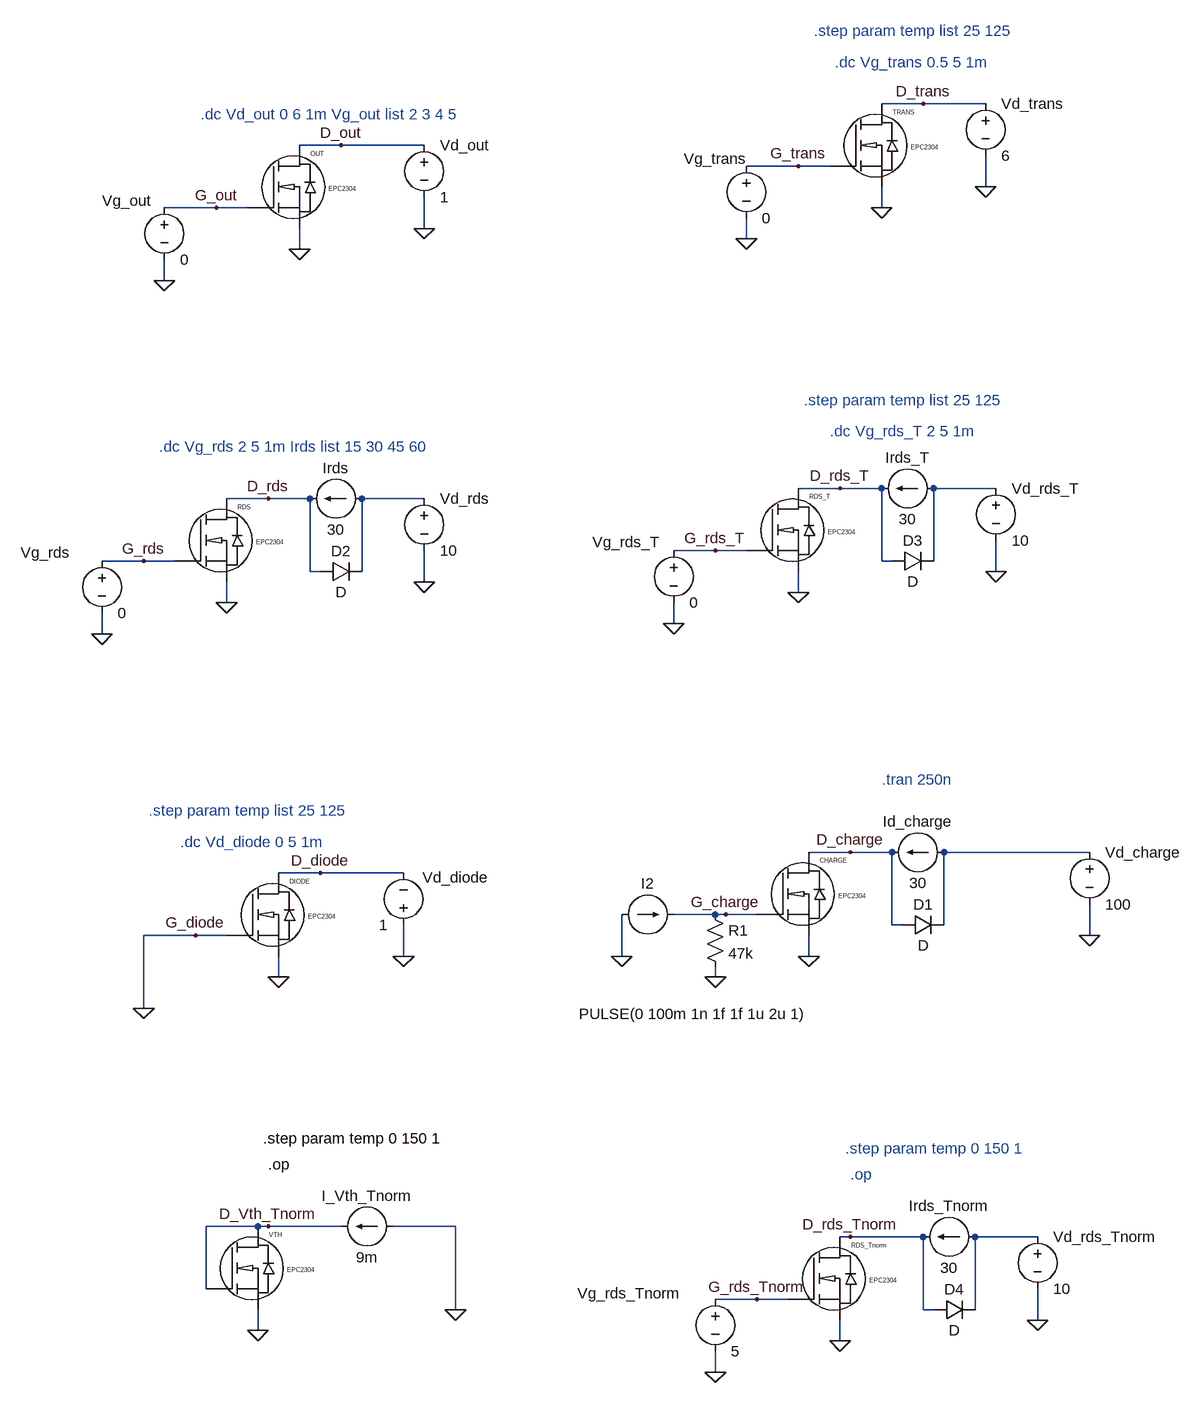
[diagram p0: schematic EPC2304_FET_Model_derivation.asc]
EPC2304_FET_Model_derivation.asc, the LTspice schematic file:
Version 4.1
SHEET 1 2668 1988
WIRE 2176 16 2112 16
WIRE 2272 16 2176 16
WIRE 1280 80 1216 80
WIRE 1408 80 1280 80
WIRE 1984 112 1904 112
WIRE 2032 112 1984 112
WIRE 2272 144 2272 96
WIRE 1088 176 1008 176
WIRE 1136 176 1088 176
WIRE 2112 176 2112 144
WIRE 1408 208 1408 160
WIRE 1904 224 1904 192
WIRE 1216 240 1216 208
WIRE 1008 288 1008 256
WIRE 2048 608 1984 608
WIRE 2112 608 2048 608
WIRE 2288 608 2192 608
WIRE 1168 624 1104 624
WIRE 1232 624 1168 624
WIRE 1408 624 1312 624
WIRE 1856 704 1792 704
WIRE 1904 704 1856 704
WIRE 976 720 912 720
WIRE 1024 720 976 720
WIRE 2112 720 2112 608
WIRE 2128 720 2112 720
WIRE 2192 720 2192 608
WIRE 1232 736 1232 624
WIRE 1248 736 1232 736
WIRE 1312 736 1312 624
WIRE 2288 736 2288 688
WIRE 1408 752 1408 704
WIRE 1984 768 1984 736
WIRE 1104 784 1104 752
WIRE 1792 816 1792 784
WIRE 912 832 912 800
WIRE 2064 1168 2000 1168
WIRE 2128 1168 2064 1168
WIRE 2432 1168 2208 1168
WIRE 1248 1200 1184 1200
WIRE 1376 1200 1248 1200
WIRE 1856 1264 1792 1264
WIRE 1872 1264 1856 1264
WIRE 1920 1264 1872 1264
WIRE 2128 1280 2128 1168
WIRE 2144 1280 2128 1280
WIRE 2208 1280 2208 1168
WIRE 1056 1296 976 1296
WIRE 1104 1296 1056 1296
WIRE 2432 1296 2432 1248
WIRE 1376 1328 1376 1280
WIRE 1712 1328 1712 1264
WIRE 2000 1328 2000 1296
WIRE 1184 1360 1184 1328
WIRE 1856 1360 1856 1344
WIRE 976 1408 976 1296
WIRE 1152 1744 1072 1744
WIRE 1168 1744 1152 1744
WIRE 1280 1744 1168 1744
WIRE 1456 1744 1360 1744
WIRE 2064 1760 2048 1760
WIRE 2176 1760 2064 1760
WIRE 2352 1760 2256 1760
WIRE 1072 1840 1072 1744
WIRE 1920 1856 1856 1856
WIRE 1968 1856 1920 1856
WIRE 1456 1872 1456 1744
WIRE 2176 1872 2176 1760
WIRE 2192 1872 2176 1872
WIRE 2256 1872 2256 1760
WIRE 2352 1888 2352 1840
WIRE 1152 1904 1152 1872
WIRE 2048 1920 2048 1888
WIRE 1856 1968 1856 1936
FLAG 2000 1328 0
FLAG 2432 1296 0
FLAG 2064 1168 D_charge
FLAG 1872 1264 G_charge
FLAG 1856 1360 0
FLAG 1216 240 0
FLAG 1008 288 0
FLAG 1408 208 0
FLAG 1280 80 D_out
FLAG 1088 176 G_out
FLAG 2112 176 0
FLAG 1904 224 0
FLAG 2272 144 0
FLAG 2176 16 D_trans
FLAG 1984 112 G_trans
FLAG 1104 784 0
FLAG 1408 752 0
FLAG 1168 624 D_rds
FLAG 912 832 0
FLAG 976 720 G_rds
FLAG 1984 768 0
FLAG 2288 736 0
FLAG 2048 608 D_rds_T
FLAG 1792 816 0
FLAG 1856 704 G_rds_T
FLAG 1712 1328 0
FLAG 1184 1360 0
FLAG 976 1408 0
FLAG 1376 1328 0
FLAG 1248 1200 D_diode
FLAG 1056 1296 G_diode
FLAG 2048 1920 0
FLAG 2352 1888 0
FLAG 2064 1760 D_rds_Tnorm
FLAG 1856 1968 0
FLAG 1920 1856 G_rds_Tnorm
FLAG 1152 1904 0
FLAG 1456 1872 0
FLAG 1168 1744 D_Vth_Tnorm
SYMBOL voltage 2432 1152 R0
SYMATTR InstName Vd_charge
SYMATTR Value 100
SYMBOL current 2208 1168 R90
WINDOW 0 -32 40 VBottom 2
WINDOW 3 32 40 VTop 2
SYMATTR InstName Id_charge
SYMATTR Value 30
SYMBOL current 1712 1264 R270
WINDOW 0 32 40 VTop 2
WINDOW 3 -137 110 VBottom 2
WINDOW 123 0 0 Left 0
WINDOW 39 0 0 Left 0
SYMATTR InstName I2
SYMATTR Value PULSE(0 100m 1n 1f 1f 1u 2u 1)
SYMBOL res 1840 1248 R0
SYMATTR InstName R1
SYMATTR Value 47k
SYMBOL diode 2144 1296 R270
WINDOW 0 32 32 VTop 2
WINDOW 3 0 32 VBottom 2
SYMATTR InstName D1
SYMBOL voltage 1008 160 R0
WINDOW 0 -96 5 Left 2
SYMATTR InstName Vg_out
SYMATTR Value 0
SYMBOL voltage 1408 64 R0
SYMATTR InstName Vd_out
SYMATTR Value 1
SYMBOL voltage 1904 96 R0
WINDOW 0 -96 5 Left 2
SYMATTR InstName Vg_trans
SYMATTR Value 0
SYMBOL voltage 2272 0 R0
SYMATTR InstName Vd_trans
SYMATTR Value 6
SYMBOL voltage 912 704 R0
WINDOW 0 -125 3 Left 2
SYMATTR InstName Vg_rds
SYMATTR Value 0
SYMBOL voltage 1408 608 R0
SYMATTR InstName Vd_rds
SYMATTR Value 10
SYMBOL current 1312 624 R90
WINDOW 0 -32 40 VBottom 2
WINDOW 3 32 40 VTop 2
SYMATTR InstName Irds
SYMATTR Value 30
SYMBOL diode 1248 752 R270
WINDOW 0 32 32 VTop 2
WINDOW 3 0 32 VBottom 2
SYMATTR InstName D2
SYMBOL voltage 1792 688 R0
WINDOW 0 -125 3 Left 2
SYMATTR InstName Vg_rds_T
SYMATTR Value 0
SYMBOL voltage 2288 592 R0
SYMATTR InstName Vd_rds_T
SYMATTR Value 10
SYMBOL current 2192 608 R90
WINDOW 0 -32 40 VBottom 2
WINDOW 3 32 40 VTop 2
SYMATTR InstName Irds_T
SYMATTR Value 30
SYMBOL diode 2128 736 R270
WINDOW 0 32 32 VTop 2
WINDOW 3 0 32 VBottom 2
SYMATTR InstName D3
SYMBOL voltage 1376 1296 R180
WINDOW 0 -131 89 Left 2
WINDOW 3 24 16 Left 2
SYMATTR InstName Vd_diode
SYMATTR Value 1
SYMBOL voltage 1856 1840 R0
WINDOW 0 -212 7 Left 2
SYMATTR InstName Vg_rds_Tnorm
SYMATTR Value 5
SYMBOL voltage 2352 1744 R0
SYMATTR InstName Vd_rds_Tnorm
SYMATTR Value 10
SYMBOL current 2256 1760 R90
WINDOW 0 -32 40 VBottom 2
WINDOW 3 32 40 VTop 2
SYMATTR InstName Irds_Tnorm
SYMATTR Value 30
SYMBOL diode 2192 1888 R270
WINDOW 0 32 32 VTop 2
WINDOW 3 0 32 VBottom 2
SYMATTR InstName D4
SYMBOL current 1360 1744 R90
WINDOW 0 -32 40 VBottom 2
WINDOW 3 32 40 VTop 2
SYMATTR InstName I_Vth_Tnorm
SYMATTR Value 9m
SYMBOL EPCGaN 1136 176 R0
SYMATTR InstName OUT
SYMBOL EPCGaN 2032 112 R0
SYMATTR InstName TRANS
SYMBOL EPCGaN 1904 704 R0
SYMATTR InstName RDS_T
SYMBOL EPCGaN 1024 720 R0
SYMATTR InstName RDS
SYMBOL EPCGaN 1104 1296 R0
SYMATTR InstName DIODE
SYMBOL EPCGaN 1920 1264 R0
SYMATTR InstName CHARGE
SYMBOL EPCGaN 1968 1856 R0
SYMATTR InstName RDS_Tnorm
SYMBOL EPCGaN 1072 1840 R0
SYMATTR InstName VTH
TEXT 1064 32 Left 2 ;.dc Vd_out 0 6 1m Vg_out list 2 3 4 5
TEXT 2040 -48 Left 2 ;.dc Vg_trans 0.5 5 1m
TEXT 2008 -96 Left 2 ;.step param temp list 25 125
TEXT 1000 544 Left 2 ;.dc Vg_rds 2 5 1m Irds list 15 30 45 60
TEXT 2112 1056 Left 2 ;.tran 250n
TEXT 2032 520 Left 2 ;.dc Vg_rds_T 2 5 1m
TEXT 1992 472 Left 2 ;.step param temp list 25 125
TEXT 1032 1152 Left 2 ;.dc Vd_diode 0 5 1m
TEXT 984 1104 Left 2 ;.step param temp list 25 125
TEXT 2056 1624 Left 2 ;.step param temp 0 150 1
TEXT 2064 1664 Left 2 ;.op
TEXT 1160 1608 Left 2 !.step param temp 0 150 1
TEXT 1168 1648 Left 2 !.op

The netlist it stands for:
* EPC2304_FET_Model_derivation.asc
Vd_charge N003 0 100
Id_charge N003 D_charge 30
I2 0 G_charge PULSE(0 100m 1n 1f 1f 1u 2u 1)
R1 G_charge 0 47k
D1 D_charge N003 D
Vg_out G_out 0 0
Vd_out D_out 0 1
Vg_trans G_trans 0 0
Vd_trans D_trans 0 6
Vg_rds G_rds 0 0
Vd_rds N002 0 10
Irds N002 D_rds 30
D2 D_rds N002 D
Vg_rds_T G_rds_T 0 0
Vd_rds_T N001 0 10
Irds_T N001 D_rds_T 30
D3 D_rds_T N001 D
Vd_diode 0 D_diode 1
Vg_rds_Tnorm G_rds_Tnorm 0 5
Vd_rds_Tnorm N004 0 10
Irds_Tnorm N004 D_rds_Tnorm 30
D4 D_rds_Tnorm N004 D
I_Vth_Tnorm 0 D_Vth_Tnorm 9m
X§OUT G_out D_out 0 EPC2304  ; pins gatein drainin sourcein
X§TRANS G_trans D_trans 0 EPC2304  ; pins gatein drainin sourcein
X§RDS_T G_rds_T D_rds_T 0 EPC2304  ; pins gatein drainin sourcein
X§RDS G_rds D_rds 0 EPC2304  ; pins gatein drainin sourcein
X§DIODE 0 D_diode 0 EPC2304  ; pins gatein drainin sourcein
X§CHARGE G_charge D_charge 0 EPC2304  ; pins gatein drainin sourcein
X§RDS_Tnorm G_rds_Tnorm D_rds_Tnorm 0 EPC2304  ; pins gatein drainin sourcein
X§VTH D_Vth_Tnorm D_Vth_Tnorm 0 EPC2304  ; pins gatein drainin sourcein
.model D D
.lib standard.dio
* .dc Vd_out 0 6 1m Vg_out list 2 3 4 5
* .dc Vg_trans 0.5 5 1m
* .step param temp list 25 125
* .dc Vg_rds 2 5 1m Irds list 15 30 45 60
* .tran 250n
* .dc Vg_rds_T 2 5 1m
* .step param temp list 25 125
* .dc Vd_diode 0 5 1m
* .step param temp list 25 125
* .step param temp 0 150 1
* .op
.step param temp 0 150 1
.op
.lib EPCGanlibrary.lib
.backanno
.end